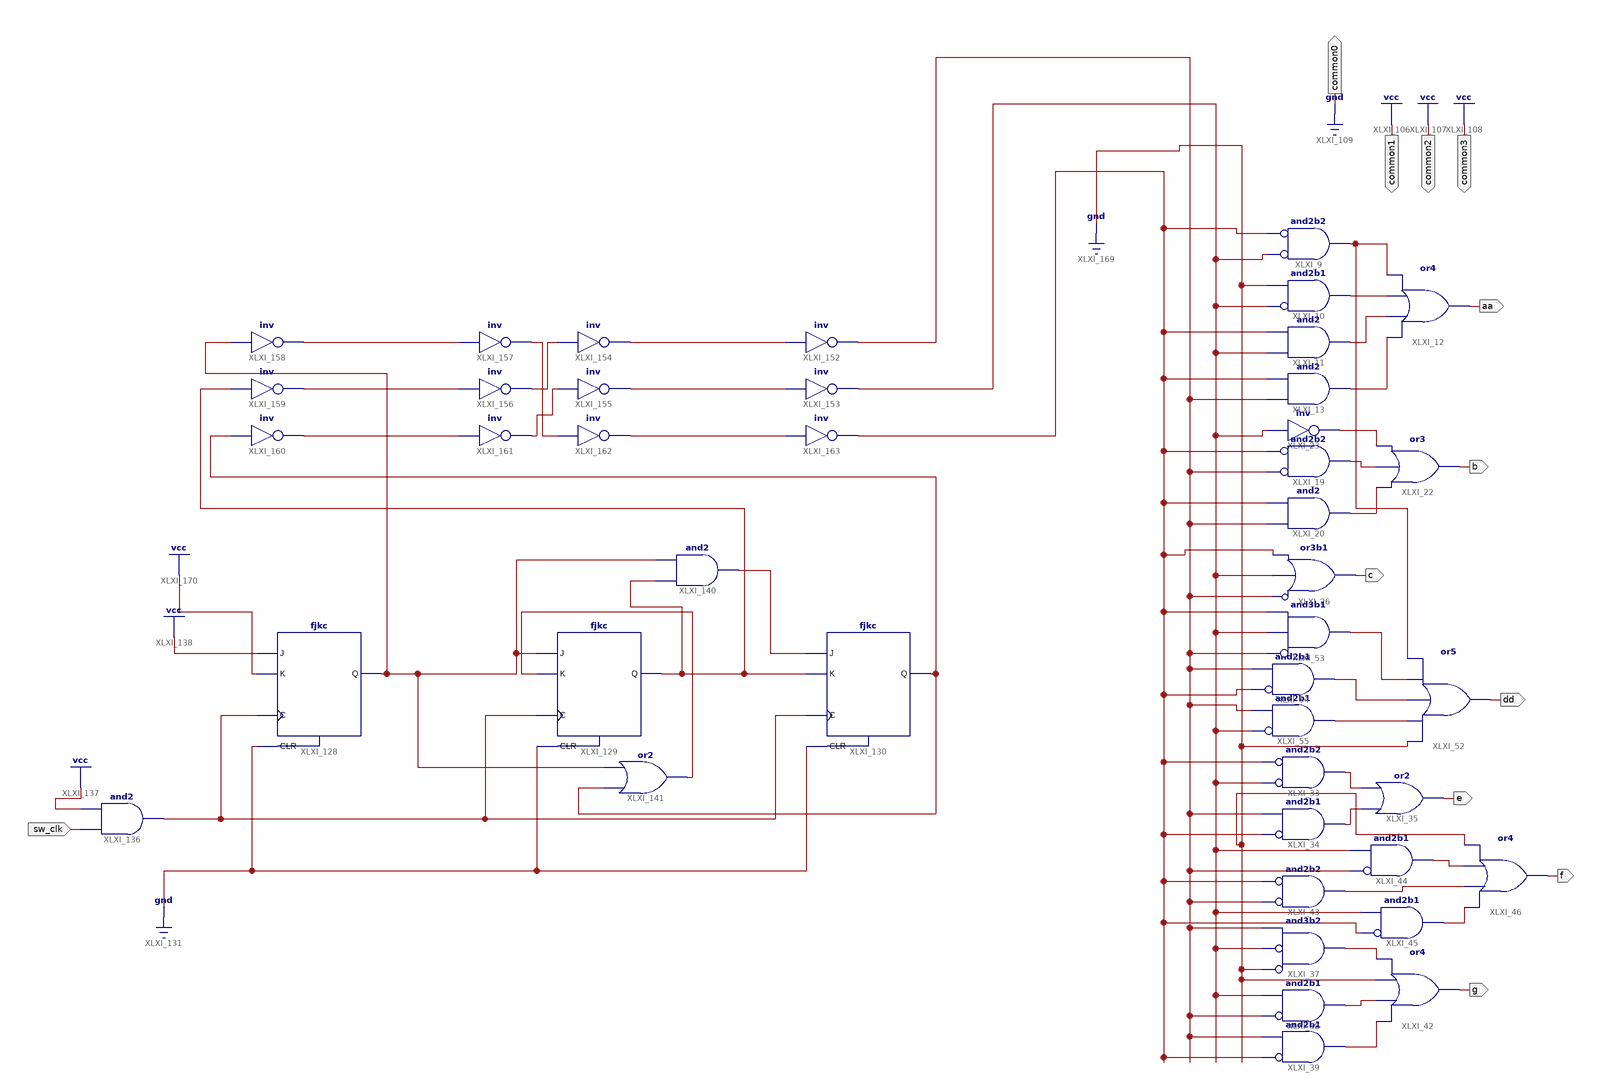
[diagram p0: schematic sheet 1]
// Xilinx ISE schematic Lab5.sch (spartan6) as structural Verilog: 43 symbols, 12 ports
module Lab5 (
  input  sw_clk,
  output dd,
  output f,
  output g,
  output e,
  output c,
  output b,
  output aa,
  output common0,
  output common1,
  output common2,
  output common3
);

  wire SW0_A, SW1_B, SW2_C, XLXN_18, XLXN_19, XLXN_20, XLXN_29, XLXN_31, XLXN_32, XLXN_43, XLXN_44, XLXN_47,
       XLXN_48, XLXN_49, XLXN_53, XLXN_54, XLXN_55, XLXN_57, XLXN_58, XLXN_59, XLXN_60, XLXN_153, XLXN_188,
       XLXN_189, XLXN_190, XLXN_191, XLXN_197, XLXN_199, XLXN_204, XLXN_207, XLXN_216, XLXN_218, XLXN_242,
       XLXN_243, XLXN_244, XLXN_247;

  and XLXI_55 (XLXN_59, ~SW2_C, SW1_B);  // and2b1
  and XLXI_54 (XLXN_58, ~SW0_A, SW1_B);  // and2b1
  and XLXI_53 (XLXN_60, ~SW1_B, SW2_C, SW0_A);  // and3b1
  or XLXI_52 (dd, 1'b0, XLXN_59, XLXN_58, XLXN_60, XLXN_57);
  or XLXI_46 (f, XLXN_55, XLXN_54, XLXN_53, 1'b0);
  and XLXI_45 (XLXN_55, ~SW0_A, SW2_C);  // and2b1
  and XLXI_44 (XLXN_53, ~SW1_B, SW2_C);  // and2b1
  and XLXI_43 (XLXN_54, ~SW1_B, ~SW0_A);  // and2b2
  or XLXI_42 (g, XLXN_49, XLXN_48, 1'b0, XLXN_47);
  and XLXI_39 (XLXN_49, ~SW0_A, SW1_B);  // and2b1
  and XLXI_38 (XLXN_48, ~SW1_B, SW2_C);  // and2b1
  and XLXI_37 (XLXN_47, ~1'b0, ~SW2_C, SW1_B);  // and3b2
  or XLXI_35 (e, XLXN_44, XLXN_43);
  and XLXI_34 (XLXN_44, ~SW0_A, SW1_B);  // and2b1
  and XLXI_33 (XLXN_43, ~SW2_C, ~SW0_A);  // and2b2
  or XLXI_26 (c, ~SW1_B, SW2_C, SW0_A);  // or3b1
  not XLXI_23 (XLXN_29, SW2_C);
  or XLXI_22 (b, XLXN_32, XLXN_31, XLXN_29);
  and XLXI_20 (XLXN_32, SW1_B, SW0_A);
  and XLXI_19 (XLXN_31, ~SW1_B, ~SW0_A);  // and2b2
  and XLXI_13 (XLXN_20, SW1_B, SW0_A);
  or XLXI_12 (aa, XLXN_20, XLXN_19, XLXN_18, XLXN_57);
  and XLXI_9 (XLXN_57, ~SW2_C, ~SW0_A);  // and2b2
  and XLXI_11 (XLXN_19, SW2_C, SW0_A);
  and XLXI_10 (XLXN_18, ~SW2_C, 1'b0);  // and2b1
  fjkc XLXI_129 (.C(XLXN_153), .CLR(1'b0), .J(XLXN_216), .K(XLXN_207), .Q(XLXN_247));
  fjkc XLXI_130 (.C(XLXN_153), .CLR(1'b0), .J(XLXN_204), .K(XLXN_247), .Q(XLXN_218));
  fjkc XLXI_128 (.C(XLXN_153), .CLR(1'b0), .J(1'b1), .K(1'b1), .Q(XLXN_216));
  and XLXI_136 (XLXN_153, sw_clk, 1'b1);
  and XLXI_140 (XLXN_204, XLXN_247, XLXN_216);
  or XLXI_141 (XLXN_207, XLXN_218, XLXN_216);
  not XLXI_152 (SW1_B, XLXN_188);
  not XLXI_153 (SW2_C, XLXN_189);
  not XLXI_154 (XLXN_188, XLXN_243);
  not XLXI_155 (XLXN_189, XLXN_244);
  not XLXI_156 (XLXN_243, XLXN_190);
  not XLXI_157 (XLXN_242, XLXN_191);
  not XLXI_158 (XLXN_191, XLXN_216);
  not XLXI_159 (XLXN_190, XLXN_247);
  not XLXI_160 (XLXN_197, XLXN_218);
  not XLXI_161 (XLXN_244, XLXN_197);
  not XLXI_162 (XLXN_199, XLXN_242);
  not XLXI_163 (SW0_A, XLXN_199);

  assign common0 = 1'b0;
  assign common1 = 1'b1;
  assign common2 = 1'b1;
  assign common3 = 1'b1;
endmodule
